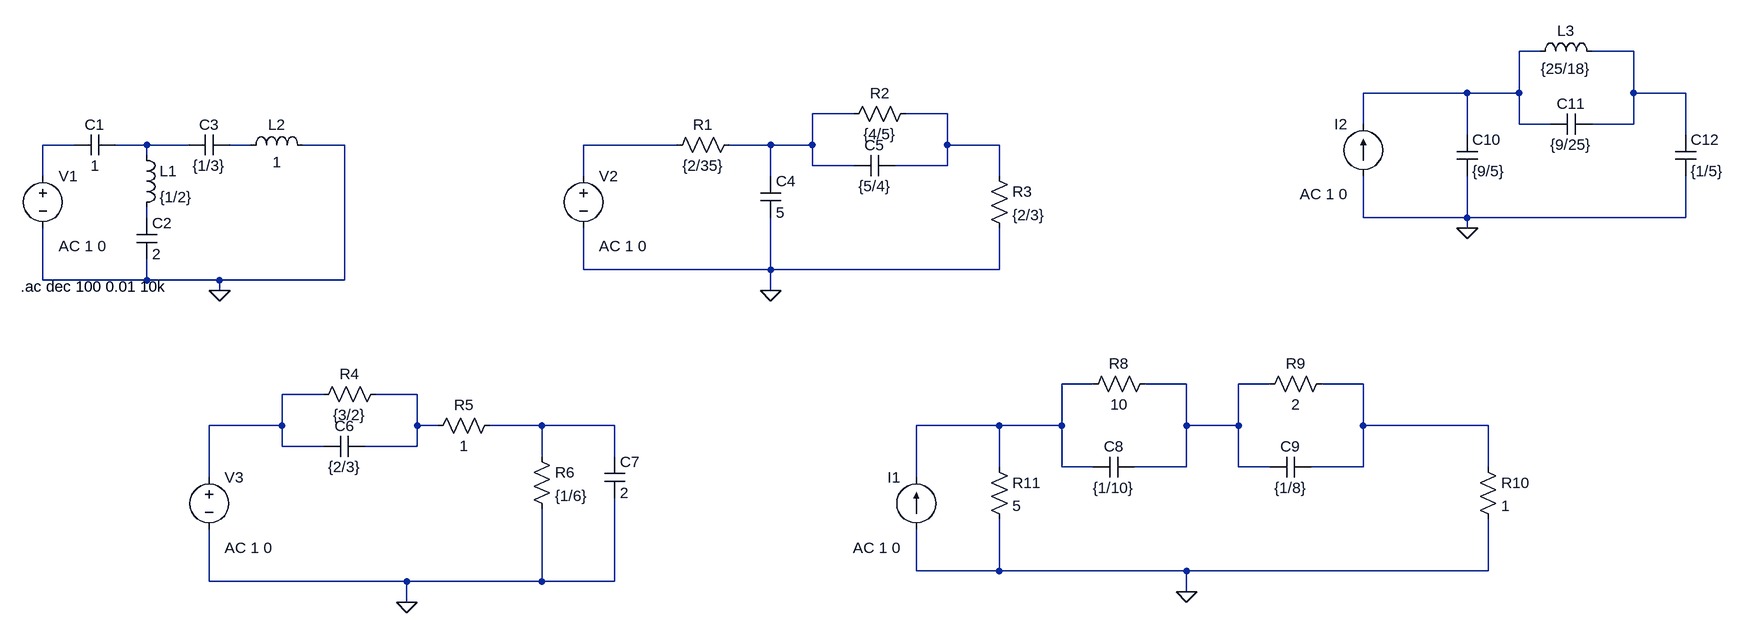
[diagram p0: schematic algunos.asc]
algunos.asc, the LTspice schematic file:
Version 4
SHEET 1 2516 836
WIRE 2208 -32 2176 -32
WIRE 2352 -32 2288 -32
WIRE 2096 32 1936 32
WIRE 2176 32 2176 -32
WIRE 2176 32 2096 32
WIRE 2352 32 2352 -32
WIRE 2432 32 2352 32
WIRE 1152 64 1088 64
WIRE 1296 64 1232 64
WIRE 1936 80 1936 32
WIRE 2176 80 2176 32
WIRE 2224 80 2176 80
WIRE 2352 80 2352 32
WIRE 2352 80 2288 80
WIRE 2096 96 2096 32
WIRE 2432 96 2432 32
WIRE -48 112 -96 112
WIRE 64 112 16 112
WIRE 128 112 64 112
WIRE 224 112 192 112
WIRE 368 112 304 112
WIRE 880 112 736 112
WIRE 1024 112 960 112
WIRE 1088 112 1088 64
WIRE 1088 112 1024 112
WIRE 1296 112 1296 64
WIRE 1376 112 1296 112
WIRE 64 128 64 112
WIRE 1088 144 1088 112
WIRE 1152 144 1088 144
WIRE 1296 144 1296 112
WIRE 1296 144 1216 144
WIRE -96 160 -96 112
WIRE 736 160 736 112
WIRE 1024 160 1024 112
WIRE 1376 160 1376 112
WIRE 64 224 64 208
WIRE 1936 224 1936 160
WIRE 2096 224 2096 160
WIRE 2096 224 1936 224
WIRE 2432 224 2432 160
WIRE 2432 224 2096 224
WIRE 2096 240 2096 224
WIRE 736 304 736 240
WIRE 1024 304 1024 224
WIRE 1024 304 736 304
WIRE 1376 304 1376 240
WIRE 1376 304 1024 304
WIRE -96 320 -96 240
WIRE 64 320 64 288
WIRE 64 320 -96 320
WIRE 176 320 64 320
WIRE 368 320 368 112
WIRE 368 320 176 320
WIRE 176 336 176 320
WIRE 1024 336 1024 304
WIRE 1520 480 1472 480
WIRE 1664 480 1600 480
WIRE 1792 480 1744 480
WIRE 1936 480 1872 480
WIRE 336 496 272 496
WIRE 480 496 416 496
WIRE 272 544 272 496
WIRE 272 544 160 544
WIRE 480 544 480 496
WIRE 512 544 480 544
WIRE 672 544 592 544
WIRE 784 544 672 544
WIRE 1376 544 1248 544
WIRE 1472 544 1472 480
WIRE 1472 544 1376 544
WIRE 1664 544 1664 480
WIRE 1744 544 1744 480
WIRE 1744 544 1664 544
WIRE 1936 544 1936 480
WIRE 2128 544 1936 544
WIRE 272 576 272 544
WIRE 336 576 272 576
WIRE 480 576 480 544
WIRE 480 576 400 576
WIRE 672 592 672 544
WIRE 784 592 784 544
WIRE 1376 608 1376 544
WIRE 1472 608 1472 544
WIRE 1520 608 1472 608
WIRE 1664 608 1664 544
WIRE 1664 608 1584 608
WIRE 1744 608 1744 544
WIRE 1792 608 1744 608
WIRE 1936 608 1936 544
WIRE 1936 608 1856 608
WIRE 2128 608 2128 544
WIRE 160 624 160 544
WIRE 1248 624 1248 544
WIRE 1248 768 1248 704
WIRE 1376 768 1376 688
WIRE 1376 768 1248 768
WIRE 1664 768 1376 768
WIRE 2128 768 2128 688
WIRE 2128 768 1664 768
WIRE 160 784 160 704
WIRE 464 784 160 784
WIRE 672 784 672 672
WIRE 672 784 464 784
WIRE 784 784 784 656
WIRE 784 784 672 784
WIRE 1664 800 1664 768
WIRE 464 816 464 784
FLAG 176 336 0
FLAG 1024 336 0
FLAG 464 816 0
FLAG 1664 800 0
FLAG 2096 240 0
SYMBOL cap 16 96 R90
WINDOW 0 0 32 VBottom 2
WINDOW 3 32 32 VTop 2
SYMATTR InstName C1
SYMATTR Value 1
SYMBOL ind 48 112 R0
SYMATTR InstName L1
SYMATTR Value {1/2}
SYMBOL cap 48 224 R0
SYMATTR InstName C2
SYMATTR Value 2
SYMBOL cap 192 96 R90
WINDOW 0 0 32 VBottom 2
WINDOW 3 32 32 VTop 2
SYMATTR InstName C3
SYMATTR Value {1/3}
SYMBOL ind 208 128 R270
WINDOW 0 32 56 VTop 2
WINDOW 3 5 56 VBottom 2
SYMATTR InstName L2
SYMATTR Value 1
SYMBOL voltage -96 144 R0
WINDOW 123 24 124 Left 2
WINDOW 39 0 0 Left 0
SYMATTR InstName V1
SYMATTR Value ""
SYMATTR Value2 AC 1 0
SYMBOL res 976 96 R90
WINDOW 0 0 56 VBottom 2
WINDOW 3 32 56 VTop 2
SYMATTR InstName R1
SYMATTR Value {2/35}
SYMBOL voltage 736 144 R0
WINDOW 123 24 124 Left 2
WINDOW 39 0 0 Left 0
SYMATTR InstName V2
SYMATTR Value ""
SYMATTR Value2 AC 1 0
SYMBOL cap 1008 160 R0
SYMATTR InstName C4
SYMATTR Value 5
SYMBOL res 1248 48 R90
WINDOW 0 0 56 VBottom 2
WINDOW 3 32 56 VTop 2
SYMATTR InstName R2
SYMATTR Value {4/5}
SYMBOL cap 1216 128 R90
WINDOW 0 0 32 VBottom 2
WINDOW 3 32 32 VTop 2
SYMATTR InstName C5
SYMATTR Value {5/4}
SYMBOL res 1360 144 R0
SYMATTR InstName R3
SYMATTR Value {2/3}
SYMBOL voltage 160 608 R0
WINDOW 123 24 124 Left 2
WINDOW 39 0 0 Left 0
SYMATTR InstName V3
SYMATTR Value ""
SYMATTR Value2 AC 1 0
SYMBOL res 432 480 R90
WINDOW 0 0 56 VBottom 2
WINDOW 3 32 56 VTop 2
SYMATTR InstName R4
SYMATTR Value {3/2}
SYMBOL cap 400 560 R90
WINDOW 0 0 32 VBottom 2
WINDOW 3 32 32 VTop 2
SYMATTR InstName C6
SYMATTR Value {2/3}
SYMBOL res 608 528 R90
WINDOW 0 0 56 VBottom 2
WINDOW 3 32 56 VTop 2
SYMATTR InstName R5
SYMATTR Value 1
SYMBOL res 656 576 R0
SYMATTR InstName R6
SYMATTR Value {1/6}
SYMBOL cap 768 592 R0
SYMATTR InstName C7
SYMATTR Value 2
SYMBOL res 1616 464 R90
WINDOW 0 0 56 VBottom 2
WINDOW 3 32 56 VTop 2
SYMATTR InstName R8
SYMATTR Value 10
SYMBOL cap 1584 592 R90
WINDOW 0 0 32 VBottom 2
WINDOW 3 32 32 VTop 2
SYMATTR InstName C8
SYMATTR Value {1/10}
SYMBOL res 1888 464 R90
WINDOW 0 0 56 VBottom 2
WINDOW 3 32 56 VTop 2
SYMATTR InstName R9
SYMATTR Value 2
SYMBOL cap 1856 592 R90
WINDOW 0 0 32 VBottom 2
WINDOW 3 32 32 VTop 2
SYMATTR InstName C9
SYMATTR Value {1/8}
SYMBOL res 2112 592 R0
SYMATTR InstName R10
SYMATTR Value 1
SYMBOL res 1360 592 R0
SYMATTR InstName R11
SYMATTR Value 5
SYMBOL current 1248 704 R180
WINDOW 0 24 80 Left 2
WINDOW 3 24 0 Left 2
WINDOW 123 24 -28 Left 2
WINDOW 39 0 0 Left 0
SYMATTR InstName I1
SYMATTR Value ""
SYMATTR Value2 AC 1 0
SYMBOL cap 2080 96 R0
SYMATTR InstName C10
SYMATTR Value {9/5}
SYMBOL current 1936 160 R180
WINDOW 0 24 80 Left 2
WINDOW 3 24 0 Left 2
WINDOW 123 24 -28 Left 2
WINDOW 39 0 0 Left 0
SYMATTR InstName I2
SYMATTR Value ""
SYMATTR Value2 AC 1 0
SYMBOL ind 2192 -16 R270
WINDOW 0 32 56 VTop 2
WINDOW 3 5 56 VBottom 2
SYMATTR InstName L3
SYMATTR Value {25/18}
SYMBOL cap 2288 64 R90
WINDOW 0 0 32 VBottom 2
WINDOW 3 32 32 VTop 2
SYMATTR InstName C11
SYMATTR Value {9/25}
SYMBOL cap 2416 96 R0
SYMATTR InstName C12
SYMATTR Value {1/5}
TEXT -130 330 Left 2 !.ac dec 100 0.01 10k

The netlist it stands for:
* algunos.asc
C1 N006 N005 1
L1 N006 N009 {1/2}
C2 N009 0 2
C3 N007 N006 {1/3}
L2 N007 0 1
V1 N005 0 AC 1 0
R1 N003 N008 {2/35}
V2 N008 0 AC 1 0
C4 N003 0 5
R2 N004 N003 {4/5}
C5 N004 N003 {5/4}
R3 N004 0 {2/3}
V3 N013 0 AC 1 0
R4 N014 N013 {3/2}
C6 N014 N013 {2/3}
R5 N015 N014 1
R6 N015 0 {1/6}
C7 N015 0 2
R8 N011 N010 10
C8 N011 N010 {1/10}
R9 N012 N011 2
C9 N012 N011 {1/8}
R10 N012 0 1
R11 N010 0 5
I1 0 N010 AC 1 0
C10 N001 0 {9/5}
I2 0 N001 AC 1 0
L3 N001 N002 {25/18}
C11 N002 N001 {9/25}
C12 N002 0 {1/5}
.ac dec 100 0.01 10k
.backanno
.end